# Altium schematic sheet CUC.SchDoc: Central microcontroller
size A4; Author: eldar6776@hotmail.com; DrawnBy: Eldar Dedic; Organization: PROVEN d.o.o.; Address1: Adema Buće 102; Address2: 71000 Sarajevo; Address3: Federacija BiH; Address4: Bosna i Hercegovina; DocumentNumber: CD-26514; Revision: 001; SheetNumber: 3; SheetTotal: 8; ProjectName: KONTROLER TRANSPORTA MATERIJALA
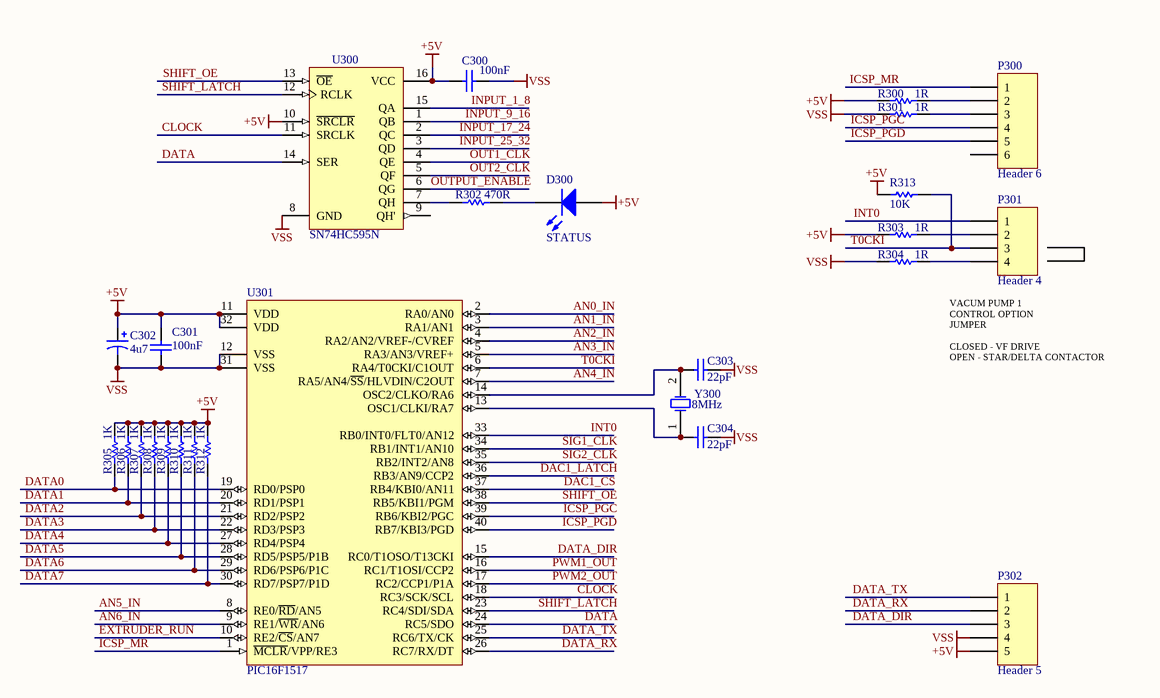
[diagram p0: CUC.SchDoc]

## Parts
C300  value 100nF  [1206]
C301  value 100nF  [1206]
C302  4u7  [94SP-C]
C303  value 22pF  [0402]
C304  value 22pF  [0402]
D300  STATUS  [3.5X2.8X1.9]
P300  Header 6  [HDR1X6]
P301  Header 4  [HDR1X4]
P302  Header 5  [HDR1X5]
R300  1R  [ERA-0805]
R301  1R  [ERA-0805]
R302  470R  [ERA-0805]
R303  1R  [ERA-0805]
R304  1R  [ERA-0805]
R305  1K  [ERA-0805]
R306  1K  [ERA-0805]
R307  1K  [ERA-0805]
R308  1K  [ERA-0805]
R309  1K  [ERA-0805]
R310  1K  [ERA-0805]
R311  1K  [ERA-0805]
R312  1K  [ERA-0805]
R313  10K  [ERA-0603]
U300  SN74HC595N  [N016]
U301  PIC16F1517  [PDIP600-P40]
Y300  8MHz  [HC49/4H_SMX]

## Nets
+5V: C300.1 C301.2 C302.1 D300.1(A) P302.5 R300.1 R303.1 R305.2 R306.2 R307.2 R308.2 R309.2 R310.2 R311.2 R312.2 R313.2 U300.10(~{SRCLR}) U300.16(VCC) U301.11(VDD) U301.32(VDD)
VSS: C300.2 C301.1 C302.2 C303.1 C304.1 P302.4 R301.1 R304.1 U300.8(GND) U301.12(VSS) U301.31(VSS)
AN0_IN: U301.2(RA0/AN0)
AN1_IN: U301.3(RA1/AN1)
AN2_IN: U301.4(RA2/AN2/VREF-/CVREF)
AN3_IN: U301.5(RA3/AN3/VREF+)
AN4_IN: U301.7(RA5/AN4/~{SS}/HLVDIN/C2OUT)
AN5_IN: U301.8(RE0/~{RD}/AN5)
AN6_IN: U301.9(RE1/~{WR}/AN6)
CLOCK: U300.11(SRCLK) U301.18(RC3/SCK/SCL)
DAC1_CS: U301.37(RB4/KBI0/AN11)
DAC1_LATCH: U301.36(RB3/AN9/CCP2)
DATA: U300.14(SER) U301.24(RC5/SDO)
DATA0: R305.1 U301.19(RD0/PSP0)
DATA1: R306.1 U301.20(RD1/PSP1)
DATA2: R307.1 U301.21(RD2/PSP2)
DATA3: R308.1 U301.22(RD3/PSP3)
DATA4: R309.1 U301.27(RD4/PSP4)
DATA5: R310.1 U301.28(RD5/PSP5/P1B)
DATA6: R311.1 U301.29(RD6/PSP6/P1C)
DATA7: R312.1 U301.30(RD7/PSP7/P1D)
DATA_DIR: P302.3 U301.15(RC0/T1OSO/T13CKI)
DATA_RX: P302.2 U301.26(RC7/RX/DT)
DATA_TX: P302.1 U301.25(RC6/TX/CK)
EXTRUDER_RUN: U301.10(RE2/~{CS}/AN7)
ICSP_MR: P300.1 U301.1(~{MCLR}/VPP/RE3)
ICSP_PGC: P300.4 U301.39(RB6/KBI2/PGC)
ICSP_PGD: P300.5 U301.40(RB7/KBI3/PGD)
INPUT_1_8: U300.15(QA)
INPUT_9_16: U300.1(QB)
INPUT_17_24: U300.2(QC)
INPUT_25_32: U300.3(QD)
INT0: P301.1 U301.33(RB0/INT0/FLT0/AN12)
OUT1_CLK: U300.4(QE)
OUT2_CLK: U300.5(QF)
OUTPUT_ENABLE: U300.6(QG)
PWM1_OUT: U301.16(RC1/T1OSI/CCP2)
PWM2_OUT: U301.17(RC2/CCP1/P1A)
SHIFT_LATCH: U300.12(RCLK) U301.23(RC4/SDI/SDA)
SHIFT_OE: U300.13(~{OE}) U301.38(RB5/KBI1/PGM)
SIG1_CLK: U301.34(RB1/INT1/AN10)
SIG2_CLK: U301.35(RB2/INT2/AN8)
T0CKI: P301.3 R313.1 U301.6(RA4/T0CKI/C1OUT)
NetC303_2: C303.2 U301.14(OSC2/CLKO/RA6) Y300.2(OSC2)
NetC304_2: C304.2 U301.13(OSC1/CLKI/RA7) Y300.1(OSC1)
NetD300_2: D300.2(K) R302.2
NetP300_2: P300.2 R300.2
NetP300_3: P300.3 R301.2
NetP301_2: P301.2 R303.2
NetP301_4: P301.4 R304.2
NetR302_1: R302.1 U300.7(QH)

Not connected (* = marked no-connect by the designer): P300 6; U300 9(QH')

## Notes on the sheet
- VACUM PUMP 1
  CONTROL OPTION
  JUMPER
  CLOSED - VF DRIVE
  OPEN - STAR/DELTA CONTACTOR
- Title
- Size:
- Date:
- A4
- Number:
- Time:
- Revision:
- Sheet
- of
- File:

## Library data of the parts
C300 C301 = C1206: Ceramic Chip Capacitor - Standard; Published: 17-Jul-2002; LatestRevisionDate: 19-Mar-2004; LatestRevisionNote: Silkscreen size reduced.; DatasheetDocument: Mar-2001; PackageDocument: Mar-2001; PackageReference: 1206; Publisher: Altium Limited; Code_JEITA: 1206; Code_IPC: 3216 [1206]; ComponentLink1Description: Manufacturer Link; ComponentLink1URL: http://www.kemet.com/; ComponentLink2Description: Datasheet; ComponentLink2URL: http://www.kemet.com/kemet/web/homepage/kechome.nsf/vapubfilesname/F3102TA.pdf/$file/F3102TA.pdf
C302 = 94SA107X0010EBP: Solid Aluminum Capacitor with Organic Semiconductor Electrolyte: 100uF, 10V, Bulk Pack; Note: Part Numbers shown are for ± 20% capacitance tolerance (X0).; PCB_Layout: Complies with Manufacturer's Recommendation.; DrillSize: Nominal, Rounded to the nearest 0.1mm; Published: 19-Mar-2004; DatasheetDocument: 29-Jun-2001; PackageReference: E; Publisher: Altium Limited; ComponentLink1Description: Manufacturer Link; ComponentLink1URL: http://www.vishay.com/; ComponentLink2Description: Datasheet; ComponentLink2URL: http://www.vishay.com/docs/90003/94sa.pdf; Value: 100uF
C303 C304 = C0402: Ceramic Chip Capacitor - Standard; Note: Footprint corresponds to dimensions for bulk cassette packaging. This case size has tightened tolerances.; Published: 17-Jul-2002; LatestRevisionDate: 19-Mar-2004; LatestRevisionNote: Silkscreen size reduced.; DatasheetDocument: Mar-2001; PackageDocument: Mar-2001; PackageReference: 0402; Publisher: Altium Limited; Code_JEITA: 0402; Code_IPC: 1005 [0402]; ComponentLink1Description: Manufacturer Link; ComponentLink1URL: http://www.kemet.com/; ComponentLink2Description: Datasheet; ComponentLink2URL: http://www.kemet.com/kemet/web/homepage/kechome.nsf/vapubfilesname/F3102TA.pdf/$file/F3102TA.pdf
D300 = LED3: Typical BLUE SiC LED; Published: 8-Jun-2000; LatestRevisionDate: 17-Dec-2003; LatestRevisionNote: PCB Footprint replaced.; DatasheetVersion: 16-Apr-2002; PackageVersion: 16-Apr-2002; PackageReference: 3.5X2.8X1.9; Publisher: Altium Limited; PackageDescription: SM LED; 2 C-Bend Leads; Body 3.5 x 2.8 x 1.9 mm, inc leads (LxWxH typ)
P300 = Header 6: Header, 6-Pin; LatestRevisionDate: 17-Jul-2002; LatestRevisionNote: Re-released for DXP Platform.; Publisher: Altium Limited
P301 = Header 4: Header, 4-Pin; LatestRevisionDate: 17-Jul-2002; LatestRevisionNote: Re-released for DXP Platform.; Publisher: Altium Limited
P302 = Header 5: Header, 5-Pin; LatestRevisionDate: 17-Jul-2002; LatestRevisionNote: Re-released for DXP Platform.; Publisher: Altium Limited
R300-R312 = ERA6Y: Rectangular Thick Film Chip Resistor, 10 Ohm to 1M Ohm Range, 0.1% and 0.5% Tolerance, 0805 Size, 0.1 W; Note: If flow soldering, adjust pad width of PCB Footprint to 0.7 - 0.8 times the width of the resistor.; Published: 17-Dec-2003; LatestRevisionDate: 19-Mar-2004; LatestRevisionNote: Silkscreen size reduced.; PackageDocument: Mar-2003; PackageReference: ERA-0805; Publisher: Altium Limited; Code_IPC: 2012 [0805]; ComponentLink1Description: Manufacturer Link; ComponentLink1URL: http://www.panasonic.com/industrial/components/resistive_products.htm; ComponentLink2Description: Datasheet; ComponentLink2URL: http://www.panasonic.com/industrial/components/pdf/AOA0000CE8.pdf
R313 = ERA3Y: Rectangular Thick Film Chip Resistor, 10 Ohm to 330k Ohm Range, 0.1% and 0.5% Tolerance, 0603 Size, 0.063 W; Note: If flow soldering, adjust pad width of PCB Footprint to 0.7 - 0.8 times the width of the resistor.; Published: 17-Dec-2003; LatestRevisionDate: 19-Mar-2004; LatestRevisionNote: Silkscreen size reduced.; PackageDocument: Mar-2003; PackageReference: ERA-0603; Publisher: Altium Limited; Code_IPC: 1608 [0603]; ComponentLink1Description: Manufacturer Link; ComponentLink1URL: http://www.panasonic.com/industrial/components/resistive_products.htm; ComponentLink2Description: Datasheet; ComponentLink2URL: http://www.panasonic.com/industrial/components/pdf/AOA0000CE8.pdf
U300 = SN74HC595N: 8-Bit Shift Register with 3-State Output Registers; Published: 8-Jun-2000; LatestRevisionDate: 04-Mar-2005; LatestRevisionNote: Stylized 3D Model Added.; DatasheetVersion: May-1997; PackageVersion: Oct-1995; PackageReference: N016; Publisher: Altium Limited; PackageDescription: DIP; 16 Leads; Row Spacing 7.62 mm; Pitch 2.54 mm; Code_JEDEC: MS-001-BB; ComponentLink1Description: Manufacturer Link; ComponentLink1URL: http://www.ti.com/; ComponentLink2Description: Datasheet; ComponentLink2URL: http://www-s.ti.com/sc/ds/sn74hc595.pdf
U301 = PIC18F4520-E/P: Enhanced Flash Microcontroller with 10-Bit A/D and nanoWatt Technology, 32K Flash, 40-Pin PDIP, Extended Temperature Range; Published: 29-Jan-2009; LatestRevisionDate: 02-Dec-2009; LatestRevisionNote: Updated to datasheet revision E, Oct-2008; DatasheetVersion: revE, Oct-2008; PackageVersion: revBB, Aug-2009; PackageReference: PDIP600-P40; Publisher: Altium Limited; PackageDescription: 40-Lead Plastic Dual In-Line (P) - 600 mil Body [PDIP]; Supplier 1: Digi-Key; Supplier Part Number 1: PIC18F4520-E/P-ND; ComponentLink1Description: Datasheet; ComponentLink1URL: http://ww1.microchip.com/downloads/en/DeviceDoc/39631E.pdf; ComponentLink2Description: Packaging Specification; ComponentLink2URL: http://www.microchip.com/stellent/groups/techpub_sg/documents/packagingspec/en012702.pdf; ComponentLink3Description: Microchip.com Home; ComponentLink3URL: http://www.microchip.com/
Y300 = HC49/4H_SMX: Surface Mount Quartz Crystal; Note: PCB layout complies with manufacturer's recommendation.; Published: 17-Jul-2002; DatasheetDocument: 18-Oct-1999; PackageDocument: 18-Oct-1999; PackageReference: HC49/4H_SMX; Publisher: Altium Limited; ComponentLink1Description: Manufacturer Link; ComponentLink1URL: http://www.cmac.com/mt/; ComponentLink2Description: Datasheet; ComponentLink2URL: http://www.cmac.com/mt/databook/crystals/smd/hc49_4h_smx.pdf